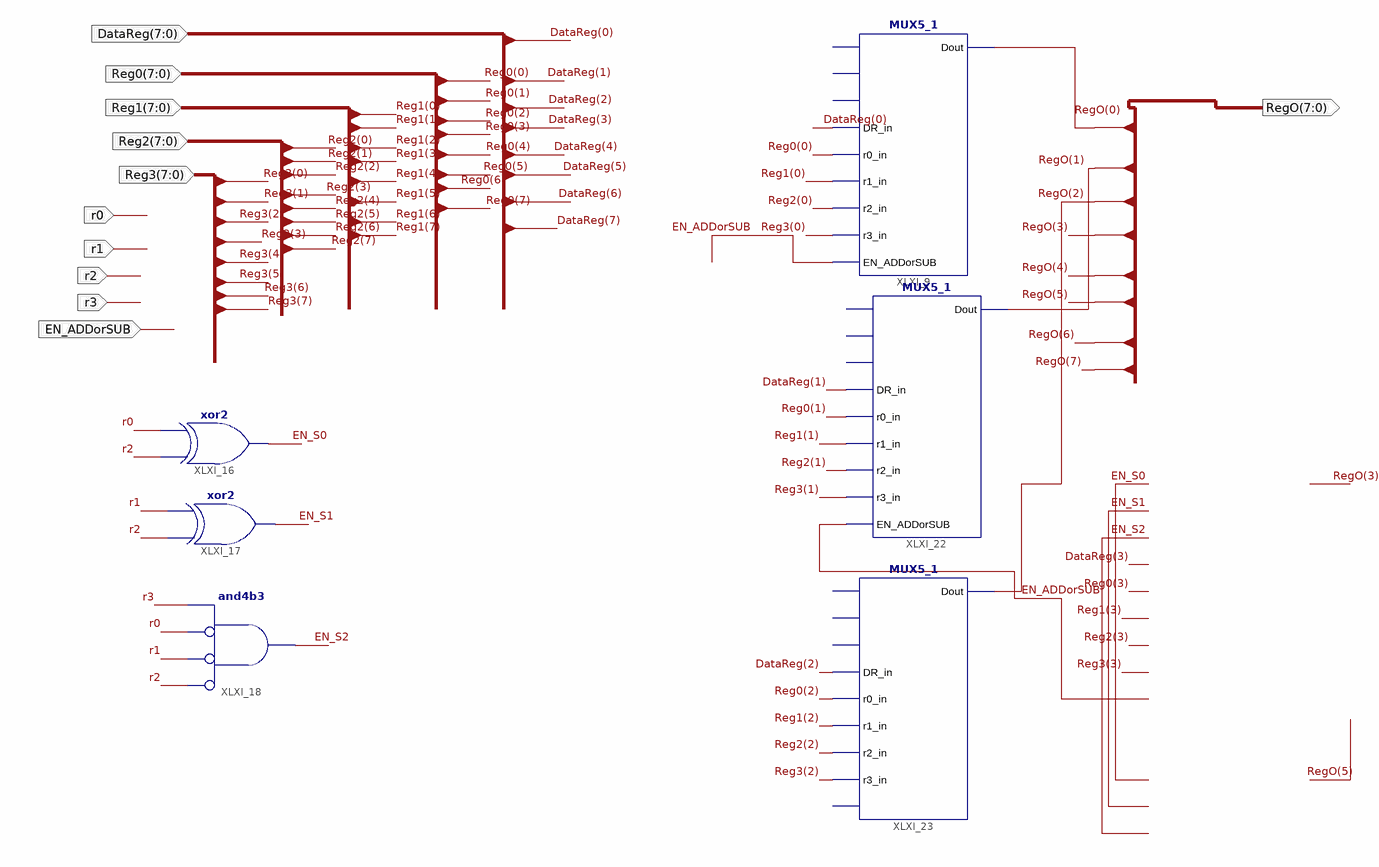
[diagram p0: schematic sheet 1]
// Xilinx ISE schematic De_MUX8bit_generic.sch (spartan3e) as structural Verilog: 6 symbols, 11 ports
module De_MUX8bit_generic (
  input  [7:0] Reg0,
  input  [7:0] Reg2,
  input  [7:0] Reg1,
  input  [7:0] Reg3,
  input  [7:0] DataReg,
  input  r2,
  input  r3,
  input  r0,
  input  r1,
  input  EN_ADDorSUB,
  output [7:0] RegO
);

  wire EN_S0, EN_S1, EN_S2;

  MUX5_1 XLXI_9 (
    .DR_in(DataReg[0]), .r0_in(Reg0[0]), .r1_in(Reg1[0]), .r2_in(Reg2[0]), .r3_in(Reg3[0]), .Dout(RegO[0]),
    .EN_ADDorSUB(EN_ADDorSUB));  // open: EN_S0, EN_S1, EN_S2
  xor XLXI_16 (EN_S0, r2, r0);
  xor XLXI_17 (EN_S1, r2, r1);
  and XLXI_18 (EN_S2, ~r2, ~r1, ~r0, r3);  // and4b3
  MUX5_1 XLXI_23 (
    .DR_in(DataReg[2]), .r0_in(Reg0[2]), .r1_in(Reg1[2]), .r2_in(Reg2[2]), .r3_in(Reg3[2]), .Dout(RegO[2]));  // open: EN_S0, EN_S1, EN_S2, EN_ADDorSUB
  MUX5_1 XLXI_22 (
    .DR_in(DataReg[1]), .r0_in(Reg0[1]), .r1_in(Reg1[1]), .r2_in(Reg2[1]), .r3_in(Reg3[1]), .Dout(RegO[1]),
    .EN_ADDorSUB(EN_ADDorSUB));  // open: EN_S0, EN_S1, EN_S2
endmodule
